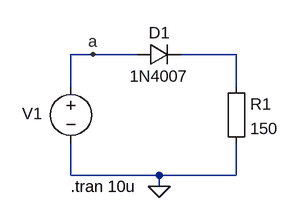
[diagram p0: schematic Diode-trr-1.asc]
Diode-trr-1.asc, the LTspice schematic file:
Version 4.1
SHEET 1 880 680
WIRE -176 128 -208 128
WIRE -112 128 -176 128
WIRE 32 128 -48 128
WIRE -208 176 -208 128
WIRE 32 176 32 128
WIRE -208 304 -208 256
WIRE -80 304 -208 304
WIRE 32 304 32 256
WIRE 32 304 -80 304
WIRE -80 320 -80 304
FLAG -80 320 0
FLAG -176 128 a
SYMBOL diode -112 144 R270
WINDOW 0 32 32 VTop 2
WINDOW 3 0 32 VBottom 2
SYMATTR InstName D1
SYMATTR Value 1N4007
SYMBOL Misc\\EuropeanResistor 16 160 R0
SYMATTR InstName R1
SYMATTR Value 150
SYMBOL voltage -208 160 R0
WINDOW 3 10 105 Invisible 2
WINDOW 123 0 0 Left 2
WINDOW 0 -71 54 Left 2
SYMATTR Value PULSE(-50 50 1u 5n 5n 3u 10u)
SYMATTR InstName V1
SYMATTR SpiceLine Rser=10
TEXT -208 320 Left 2 !.tran 10u

The netlist it stands for:
* Diode-trr-1.asc
D1 a N001 1N4007
R1 N001 0 150
V1 a 0 PULSE(-50 50 1u 5n 5n 3u 10u) Rser=10
.model D D
.lib standard.dio
.tran 10u
.backanno
.end